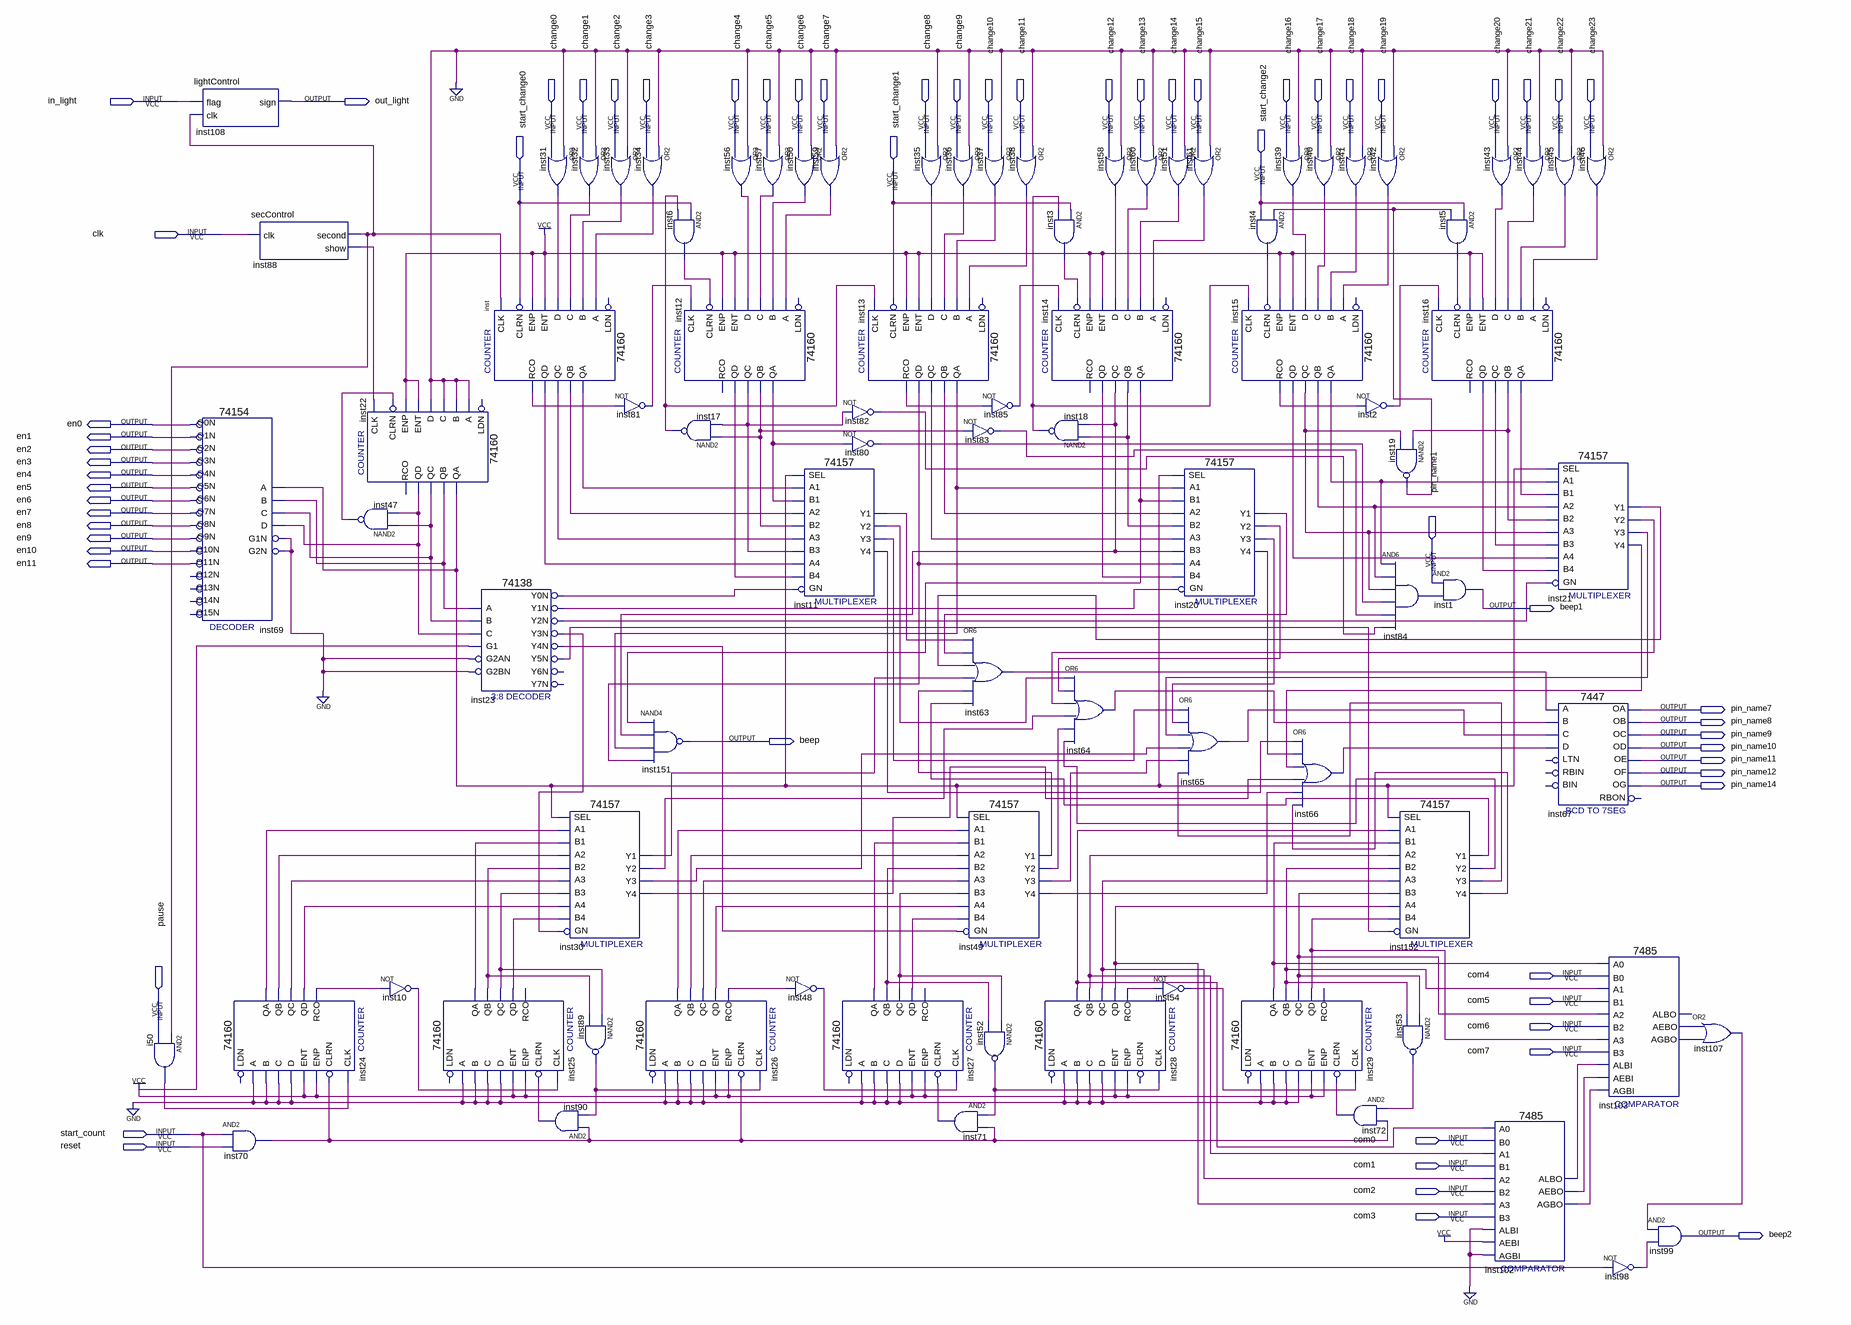
[diagram p0: schematic sheet]
// Quartus schematic MyClock.bdf as structural Verilog: 85 symbols, 64 pins
module MyClock (
  input  in_light,
  input  change0,
  input  change1,
  input  change2,
  input  change3,
  input  change4,
  input  change5,
  input  change6,
  input  change7,
  input  change8,
  input  change9,
  input  change10,
  input  change11,
  input  change12,
  input  change13,
  input  change14,
  input  change15,
  input  change16,
  input  change17,
  input  change18,
  input  change19,
  input  change20,
  input  change21,
  input  change22,
  input  change23,
  input  start_change2,
  input  start_change0,
  input  start_change1,
  input  clk,
  input  pin_name1,
  input  com4,
  input  com5,
  input  com6,
  input  pause,
  input  com7,
  input  start_count,
  input  com0,
  input  reset,
  input  com1,
  input  com2,
  input  com3,
  output out_light,
  output en0,
  output en1,
  output en2,
  output en3,
  output en4,
  output en5,
  output en6,
  output en7,
  output en8,
  output en9,
  output en10,
  output en11,
  output beep1,
  output pin_name7,
  output pin_name8,
  output pin_name9,
  output beep,
  output pin_name10,
  output pin_name11,
  output pin_name12,
  output pin_name14,
  output beep2
);

  wire i50_out, inst2_out, inst3_out, inst4_out, inst5_out, inst6_out, inst10_out, inst11_y1, inst11_y2,
       inst11_y3, inst11_y4, inst12_qa, inst12_qb, inst12_qc, inst12_qd, inst13_qa, inst13_qb, inst13_qc,
       inst13_qd, inst13_rco, inst14_qa, inst14_qb, inst14_qc, inst14_qd, inst15_qa, inst15_qb, inst15_qc,
       inst15_qd, inst15_rco, inst16_qa, inst16_qb, inst16_qc, inst16_qd, inst17_out, inst18_out, inst19_out,
       inst20_y1, inst20_y2, inst20_y3, inst20_y4, inst21_y1, inst21_y2, inst21_y3, inst21_y4, inst22_qa,
       inst22_qb, inst22_qc, inst22_qd, inst23_y0n, inst23_y1n, inst23_y2n, inst23_y3n, inst23_y4n,
       inst23_y5n, inst24_qa, inst24_qb, inst24_qc, inst24_qd, inst24_rco, inst25_qa, inst25_qb, inst25_qc,
       inst25_qd, inst26_qa, inst26_qb, inst26_qc, inst26_qd, inst26_rco, inst27_qa, inst27_qb, inst27_qc,
       inst27_qd, inst28_qa, inst28_qb, inst28_qc, inst28_qd, inst28_rco, inst29_qa, inst29_qb, inst29_qc,
       inst29_qd, inst30_y1, inst30_y2, inst30_y3, inst30_y4, inst31_out, inst32_out, inst33_out, inst34_out,
       inst35_out, inst36_out, inst37_out, inst38_out, inst39_out, inst40_out, inst41_out, inst42_out,
       inst43_out, inst44_out, inst45_out, inst46_out, inst47_out, inst48_out, inst49_y1, inst49_y2,
       inst49_y3, inst49_y4, inst50_out, inst51_out, inst52_out, inst53_out, inst54_out, inst56_out,
       inst57_out, inst58_out, inst59_out, inst60_out, inst61_out, inst63_out, inst64_out, inst65_out,
       inst66_out, inst70_out, inst71_out, inst72_out, inst80_out, inst81_out, inst82_out, inst83_out,
       inst84_out, inst85_out, inst88_second, inst88_show, inst89_out, inst90_out, inst98_out, inst102_aebo,
       inst102_agbo, inst102_albo, inst103_aebo, inst103_agbo, inst107_out, inst152_y1, inst152_y2,
       inst152_y3, inst152_y4, inst_qa, inst_qb, inst_qc, inst_qd, inst_rco;

  and i50 (i50_out, inst88_second, pause);
  lightControl inst108 (.flag(in_light), .clk(inst88_second), .sign(out_light));
  \74154  inst69 (
    .C(inst22_qc), .D(inst22_qd), .B(inst22_qb), .A(inst22_qa), .G1N(1'b0), .G2N(1'b0), .O0N(en0),
    .O10N(en10), .O11N(en11), .O1N(en1), .O4N(en4), .O3N(en3), .O2N(en2), .O7N(en7), .O6N(en6), .O5N(en5),
    .O9N(en9), .O8N(en8));  // open: O12N, O15N, O13N, O14N
  \74160  inst24 (
    .CLK(i50_out), .ENT(1'b1), .A(1'b0), .B(1'b0), .C(1'b0), .D(1'b0), .ENP(1'b1), .CLRN(inst70_out),
    .QD(inst24_qd), .QA(inst24_qa), .QB(inst24_qb), .QC(inst24_qc), .RCO(inst24_rco));  // open: LDN
  and inst70 (inst70_out, start_count, reset);
  secControl inst88 (.clk(clk), .second(inst88_second), .show(inst88_show));
  \74160  inst22 (
    .CLK(inst88_show), .ENT(1'b1), .A(1'b0), .B(1'b0), .C(1'b0), .D(1'b0), .ENP(1'b1), .CLRN(inst47_out),
    .QD(inst22_qd), .QA(inst22_qa), .QB(inst22_qb), .QC(inst22_qc));  // open: LDN, RCO
  nand inst47 (inst47_out, inst22_qc, inst22_qd);
  not inst10 (inst10_out, inst24_rco);
  \74160  inst25 (
    .CLK(inst10_out), .ENT(1'b1), .A(1'b0), .B(1'b0), .C(1'b0), .D(1'b0), .ENP(1'b1), .CLRN(inst90_out),
    .QD(inst25_qd), .QA(inst25_qa), .QB(inst25_qb), .QC(inst25_qc));  // open: LDN, RCO
  \74160  inst (
    .CLK(inst88_second), .ENT(1'b1), .A(inst34_out), .B(inst33_out), .C(inst32_out), .D(inst31_out),
    .ENP(1'b1), .CLRN(start_change0), .QD(inst_qd), .QA(inst_qa), .QB(inst_qb), .QC(inst_qc), .RCO(inst_rco));  // open: LDN
  \74138  inst23 (
    .A(inst22_qb), .B(inst22_qc), .G1(1'b1), .C(inst22_qd), .G2AN(1'b0), .G2BN(1'b0), .Y0N(inst23_y0n),
    .Y1N(inst23_y1n), .Y2N(inst23_y2n), .Y3N(inst23_y3n), .Y4N(inst23_y4n), .Y5N(inst23_y5n));  // open: Y6N, Y7N
  or inst31 (inst31_out, 1'b0, change0);
  or inst32 (inst32_out, 1'b0, change1);
  \74157  inst30 (
    .A1(inst24_qa), .B1(inst25_qa), .SEL(inst22_qa), .B2(inst25_qb), .A3(inst24_qc), .B3(inst25_qc),
    .A2(inst24_qb), .B4(inst25_qd), .GN(inst23_y3n), .A4(inst24_qd), .Y2(inst30_y2), .Y1(inst30_y1),
    .Y4(inst30_y4), .Y3(inst30_y3));
  nand inst89 (inst89_out, inst25_qc, inst25_qb);
  and inst90 (inst90_out, inst70_out, inst89_out);
  or inst33 (inst33_out, 1'b0, change2);
  or inst34 (inst34_out, 1'b0, change3);
  not inst81 (inst81_out, inst_rco);
  \74160  inst26 (
    .CLK(inst89_out), .ENT(1'b1), .A(1'b0), .B(1'b0), .C(1'b0), .D(1'b0), .ENP(1'b1), .CLRN(inst70_out),
    .QD(inst26_qd), .QA(inst26_qa), .QB(inst26_qb), .QC(inst26_qc), .RCO(inst26_rco));  // open: LDN
  and inst6 (inst6_out, start_change0, inst17_out);
  \74160  inst12 (
    .CLK(inst81_out), .ENT(1'b1), .A(inst59_out), .B(inst50_out), .C(inst57_out), .D(inst56_out), .ENP(1'b1),
    .CLRN(inst6_out), .QD(inst12_qd), .QA(inst12_qa), .QB(inst12_qb), .QC(inst12_qc));  // open: LDN, RCO
  nand inst17 (inst17_out, inst12_qb, inst12_qc);
  nand inst151 (beep, inst14_qa, inst14_qc, inst13_qa, inst13_qd);
  or inst56 (inst56_out, 1'b0, change4);
  or inst57 (inst57_out, 1'b0, change5);
  or inst50 (inst50_out, 1'b0, change6);
  not inst48 (inst48_out, inst26_rco);
  or inst59 (inst59_out, 1'b0, change7);
  \74157  inst11 (
    .A1(inst_qa), .B1(inst12_qa), .SEL(inst22_qa), .B2(inst12_qb), .A3(inst_qc), .B3(inst12_qc),
    .A2(inst_qb), .B4(inst12_qd), .GN(inst23_y0n), .A4(inst_qd), .Y2(inst11_y2), .Y1(inst11_y1),
    .Y4(inst11_y4), .Y3(inst11_y3));
  \74160  inst27 (
    .CLK(inst48_out), .ENT(1'b1), .A(1'b0), .B(1'b0), .C(1'b0), .D(1'b0), .ENP(1'b1), .CLRN(inst71_out),
    .QD(inst27_qd), .QA(inst27_qa), .QB(inst27_qb), .QC(inst27_qc));  // open: LDN, RCO
  \74160  inst13 (
    .CLK(inst17_out), .ENT(1'b1), .A(inst38_out), .B(inst37_out), .C(inst36_out), .D(inst35_out), .ENP(1'b1),
    .CLRN(start_change1), .QD(inst13_qd), .QA(inst13_qa), .QB(inst13_qb), .QC(inst13_qc), .RCO(inst13_rco));  // open: LDN
  not inst82 (inst82_out, inst12_qc);
  not inst80 (inst80_out, inst12_qa);
  or inst35 (inst35_out, 1'b0, change8);
  and inst71 (inst71_out, inst52_out, inst70_out);
  or inst36 (inst36_out, 1'b0, change9);
  or inst37 (inst37_out, 1'b0, change10);
  not inst85 (inst85_out, inst13_rco);
  not inst83 (inst83_out, inst12_qb);
  or inst63 (inst63_out, inst11_y1, inst20_y1, inst21_y1, inst30_y1, inst49_y1, inst152_y1);
  \74157  inst49 (
    .A1(inst26_qa), .B1(inst27_qa), .SEL(inst22_qa), .B2(inst27_qb), .A3(inst26_qc), .B3(inst27_qc),
    .A2(inst26_qb), .B4(inst27_qd), .GN(inst23_y4n), .A4(inst26_qd), .Y2(inst49_y2), .Y1(inst49_y1),
    .Y4(inst49_y4), .Y3(inst49_y3));
  nand inst52 (inst52_out, inst27_qc, inst27_qb);
  or inst38 (inst38_out, 1'b0, change11);
  \74160  inst14 (
    .CLK(inst85_out), .ENT(1'b1), .A(inst61_out), .B(inst51_out), .C(inst60_out), .D(inst58_out), .ENP(1'b1),
    .CLRN(inst3_out), .QD(inst14_qd), .QA(inst14_qa), .QB(inst14_qb), .QC(inst14_qc));  // open: LDN, RCO
  nand inst18 (inst18_out, inst14_qb, inst14_qc);
  \74160  inst28 (
    .CLK(inst52_out), .ENT(1'b1), .A(1'b0), .B(1'b0), .C(1'b0), .D(1'b0), .ENP(1'b1), .QD(inst28_qd),
    .QA(inst28_qa), .QB(inst28_qb), .QC(inst28_qc), .RCO(inst28_rco));  // open: LDN, CLRN
  and inst3 (inst3_out, start_change1, inst18_out);
  or inst64 (inst64_out, inst11_y2, inst20_y2, inst21_y2, inst30_y2, inst49_y2, inst152_y2);
  or inst58 (inst58_out, 1'b0, change12);
  or inst60 (inst60_out, 1'b0, change13);
  or inst61 (inst61_out, 1'b0, change15);
  or inst51 (inst51_out, 1'b0, change14);
  \74157  inst20 (
    .A1(inst13_qa), .B1(inst14_qa), .SEL(inst22_qa), .B2(inst14_qb), .A3(inst13_qc), .B3(inst14_qc),
    .A2(inst13_qb), .B4(inst14_qd), .GN(inst23_y1n), .A4(inst13_qd), .Y2(inst20_y2), .Y1(inst20_y1),
    .Y4(inst20_y4), .Y3(inst20_y3));
  or inst65 (inst65_out, inst11_y3, inst20_y3, inst21_y3, inst30_y3, inst49_y3, inst152_y3);
  not inst54 (inst54_out, inst28_rco);
  \74160  inst15 (
    .CLK(inst18_out), .ENT(1'b1), .A(inst42_out), .B(inst41_out), .C(inst40_out), .D(inst39_out), .ENP(1'b1),
    .CLRN(inst4_out), .QD(inst15_qd), .QA(inst15_qa), .QB(inst15_qb), .QC(inst15_qc), .RCO(inst15_rco));  // open: LDN
  \74160  inst29 (
    .CLK(inst54_out), .ENT(1'b1), .A(1'b0), .B(1'b0), .C(1'b0), .D(1'b0), .ENP(1'b1), .CLRN(inst72_out),
    .QD(inst29_qd), .QA(inst29_qa), .QB(inst29_qb), .QC(inst29_qc));  // open: LDN, RCO
  or inst39 (inst39_out, 1'b0, change16);
  and inst4 (inst4_out, inst19_out, start_change2);
  or inst66 (inst66_out, inst11_y4, inst20_y4, inst21_y4, inst30_y4, inst49_y4, inst152_y4);
  or inst40 (inst40_out, 1'b0, change17);
  or inst41 (inst41_out, 1'b0, change18);
  and inst72 (inst72_out, inst53_out, inst70_out);
  or inst42 (inst42_out, 1'b0, change19);
  not inst2 (inst2_out, inst15_rco);
  nand inst19 (inst19_out, inst16_qb, inst15_qc);
  and inst84 (inst84_out, inst15_qa, inst15_qb, inst15_qc, inst80_out, inst83_out, inst82_out);
  \74157  inst152 (
    .A1(inst28_qa), .B1(inst29_qa), .SEL(inst22_qa), .B2(inst29_qb), .A3(inst28_qc), .B3(inst29_qc),
    .A2(inst28_qb), .B4(inst29_qd), .GN(inst23_y5n), .A4(inst28_qd), .Y2(inst152_y2), .Y1(inst152_y1),
    .Y4(inst152_y4), .Y3(inst152_y3));
  nand inst53 (inst53_out, inst29_qc, inst29_qb);
  and inst5 (inst5_out, start_change2, inst19_out);
  \74160  inst16 (
    .CLK(inst2_out), .ENT(1'b1), .A(inst46_out), .B(inst45_out), .C(inst44_out), .D(inst43_out), .ENP(1'b1),
    .CLRN(inst5_out), .QD(inst16_qd), .QA(inst16_qa), .QB(inst16_qb), .QC(inst16_qc));  // open: LDN, RCO
  and inst1 (beep1, pin_name1, inst84_out);
  or inst43 (inst43_out, 1'b0, change20);
  \7485  inst102 (
    .A3(inst28_qd), .B2(com2), .A2(inst28_qc), .AEBI(1'b1), .AGBI(1'b0), .ALBI(1'b0), .A0(inst28_qa),
    .B0(com0), .B3(com3), .A1(inst28_qb), .B1(com1), .ALBO(inst102_albo), .AGBO(inst102_agbo),
    .AEBO(inst102_aebo));
  or inst44 (inst44_out, 1'b0, change21);
  or inst45 (inst45_out, 1'b0, change22);
  \74157  inst21 (
    .A1(inst15_qa), .B1(inst16_qa), .SEL(inst22_qa), .B2(inst16_qb), .A3(inst15_qc), .B3(inst16_qc),
    .A2(inst15_qb), .B4(inst16_qd), .GN(inst23_y2n), .A4(inst15_qd), .Y2(inst21_y2), .Y1(inst21_y1),
    .Y4(inst21_y4), .Y3(inst21_y3));
  \7447  inst67 (
    .B(inst64_out), .C(inst65_out), .D(inst66_out), .A(inst63_out), .OB(pin_name8), .OC(pin_name9),
    .OE(pin_name11), .OD(pin_name10), .OF(pin_name12), .OG(pin_name14), .OA(pin_name7));  // open: LTN, RBIN, BIN, RBON
  or inst46 (inst46_out, 1'b0, change23);
  \7485  inst103 (
    .A3(inst29_qd), .B2(com6), .A2(inst29_qc), .AEBI(inst102_aebo), .AGBI(inst102_agbo), .ALBI(inst102_albo),
    .A0(inst29_qa), .B0(com4), .B3(com7), .A1(inst29_qb), .B1(com5), .AGBO(inst103_agbo), .AEBO(inst103_aebo));  // open: ALBO
  and inst99 (beep2, inst107_out, inst98_out);
  not inst98 (inst98_out, start_count);
  or inst107 (inst107_out, inst103_aebo, inst103_agbo);
endmodule
